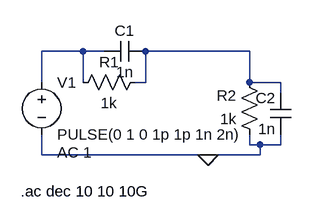
[diagram p0: schematic Draft11.asc]
Draft11.asc, the LTspice schematic file:
Version 4
SHEET 1 880 680
WIRE 96 96 32 96
WIRE 128 96 96 96
WIRE 352 96 192 96
WIRE 32 144 32 96
WIRE 96 144 96 96
WIRE 192 144 192 96
WIRE 192 144 176 144
WIRE 352 144 352 96
WIRE 400 144 352 144
WIRE 400 160 400 144
WIRE 352 240 352 224
WIRE 368 240 352 240
WIRE 400 240 400 224
WIRE 400 240 368 240
WIRE 32 256 32 224
WIRE 288 256 32 256
WIRE 368 256 368 240
WIRE 368 256 288 256
FLAG 288 256 0
SYMBOL cap 192 80 R90
WINDOW 0 0 32 VBottom 2
WINDOW 3 32 32 VTop 2
SYMATTR InstName C1
SYMATTR Value 1n
SYMBOL cap 416 224 R180
WINDOW 0 24 56 Left 2
WINDOW 3 24 8 Left 2
SYMATTR InstName C2
SYMATTR Value 1n
SYMBOL res 368 240 R180
WINDOW 0 36 76 Left 2
WINDOW 3 36 40 Left 2
SYMATTR InstName R2
SYMATTR Value 1k
SYMBOL res 192 128 R90
WINDOW 0 0 56 VBottom 2
WINDOW 3 32 56 VTop 2
SYMATTR InstName R1
SYMATTR Value 1k
SYMBOL voltage 32 128 R0
WINDOW 123 24 124 Left 2
WINDOW 39 0 0 Left 0
SYMATTR InstName V1
SYMATTR Value PULSE(0 1 0 1p 1p 1n 2n)
SYMATTR Value2 AC 1
TEXT 0 312 Left 2 !.ac dec 10 10 10G

The netlist it stands for:
* Draft11.asc
C1 N002 N001 1n
C2 0 N002 1n
R2 0 N002 1k
R1 N002 N001 1k
V1 N001 0 PULSE(0 1 0 1p 1p 1n 2n) AC 1
.ac dec 10 10 10G
.backanno
.end